# EAGLE design DIYpiano (EAGLE 9.2.2)
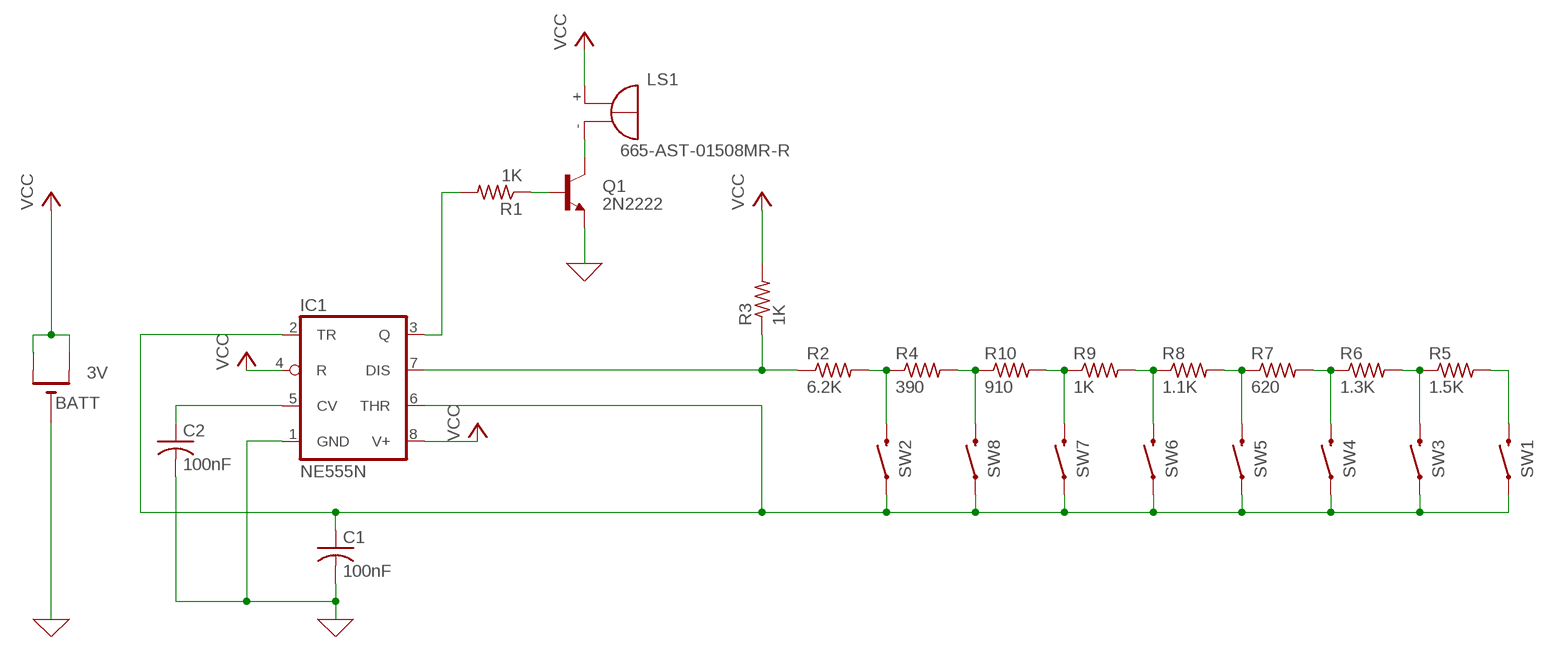
[diagram p0: schematic, sheet 1]

## Parts
BATT  3V  CR1220THM  [CR1220-THM]
C1  100nF  C-US025-025X050  [C025-025X050]
C2  100nF  C-US025-025X050  [C025-025X050]
IC1  NE555N  [DIL08]
LS1  F/HMB  [F/HMB]
Q1  2N2222  -NPN-TO92-E1  [TO92-E1]
R1  1K  R-US_0207/10  [0207/10]
R2  6.2K  R-US_0207/10  [0207/10]
R3  1K  R-US_0207/10  [0207/10]
R4  390  R-US_0207/10  [0207/10]
R5  1.5K  R-US_0207/10  [0207/10]
R6  1.3K  R-US_0207/10  [0207/10]
R7  620  R-US_0207/10  [0207/10]
R8  1.1K  R-US_0207/10  [0207/10]
R9  1K  R-US_0207/10  [0207/10]
R10  910  R-US_0207/10  [0207/10]
SW1  MOMENTARY-SWITCH-SPST-PTH-6.0MM  [TACTILE_SWITCH_PTH_6.0MM]
SW2  MOMENTARY-SWITCH-SPST-PTH-6.0MM  [TACTILE_SWITCH_PTH_6.0MM]
SW3  MOMENTARY-SWITCH-SPST-PTH-6.0MM  [TACTILE_SWITCH_PTH_6.0MM]
SW4  MOMENTARY-SWITCH-SPST-PTH-6.0MM  [TACTILE_SWITCH_PTH_6.0MM]
SW5  MOMENTARY-SWITCH-SPST-PTH-6.0MM  [TACTILE_SWITCH_PTH_6.0MM]
SW6  MOMENTARY-SWITCH-SPST-PTH-6.0MM  [TACTILE_SWITCH_PTH_6.0MM]
SW7  MOMENTARY-SWITCH-SPST-PTH-6.0MM  [TACTILE_SWITCH_PTH_6.0MM]
SW8  MOMENTARY-SWITCH-SPST-PTH-6.0MM  [TACTILE_SWITCH_PTH_6.0MM]

## Nets
GND: BATT.- C1.2 C2.2 IC1.1(GND) Q1.3(E)
N$1: R2.2 R4.1 SW2.3
N$2: IC1.7(DIS) R2.1 R3.1
N$3: C1.1 IC1.2(TR) IC1.6(THR) SW1.1 SW2.1 SW3.1 SW4.1 SW5.1 SW6.1 SW7.1 SW8.1
N$4: R4.2 R10.1 SW8.3
N$5: R9.1 R10.2 SW7.3
N$6: R8.1 R9.2 SW6.3
N$7: R7.1 R8.2 SW5.3
N$8: R6.1 R7.2 SW4.3
N$9: R5.1 R6.2 SW3.3
N$10: R5.2 SW1.3
N$11: IC1.3(Q) R1.2
N$12: C2.1 IC1.5(CV)
N$13: LS1.- Q1.1(C)
N$14: Q1.2(B) R1.1
VCC: BATT.+1(+) BATT.+2(+1) IC1.4(R) IC1.8(V+) LS1.+ R3.2

## Library data of the parts
BATT = adafruit:CR1220: CR1216/CR1220/CR1225 12mm 3V lithium coin cell Great for battery packup. Both SMT and THM holders. Note the THM package has the ground pads on both sides of the PCB so that the masks are the same - this reduces the cost; MF: KEYSTONE ELECTR; MOUSER#: 534-3001; MPN: 3001; OC_NEWARK: 66F5623
C1 C2 = rcl:C-US: CAPACITOR, American symbol; MOUSER#: 581-SR201C104KARTR1; OC_NEWARK: unknown; SPICEPREFIX: C
IC1 = linear:*555: TIMER; MOUSER#: 595-TLC555CP; MPN: TLC555CP; OC_NEWARK: 24M8296
LS1 = buzzer:F/HMB: BUZZER Source: Buerklin; MOUSER#: 665-AST-01508MR-R; OC_FARNELL: unknown; OC_NEWARK: unknown
Q1 = transistor:*-NPN-: NPN Transistror BF959 corrected 2008.03.06; MF: FAIRCHILD SEMICONDUCTOR; MOUSER#: 833-PN2222A-AP; MPN: PN2222ATF; OC_NEWARK: 58K2048
R1 R3 R9 = rcl:R-US_: RESISTOR, American symbol; MOUSER#: 660-MF1/4DCT26A1001F; OC_NEWARK: unknown; SPICEPREFIX: R
R2 = rcl:R-US_: RESISTOR, American symbol; MOUSER#: 603-MFR-25FRF52-6K2; OC_NEWARK: unknown; SPICEPREFIX: R
R4 = rcl:R-US_: RESISTOR, American symbol; MOUSER#: 603-MFR-25FTE52-390R; OC_NEWARK: unknown; SPICEPREFIX: R
R5 = rcl:R-US_: RESISTOR, American symbol; MOUSER#: 603-MFR-25FBF52-1K5; OC_NEWARK: unknown; SPICEPREFIX: R
R6 = rcl:R-US_: RESISTOR, American symbol; MOUSER#: 603-MFR-25FBF52-1K3; OC_NEWARK: unknown; SPICEPREFIX: R
R7 = rcl:R-US_: RESISTOR, American symbol; MOUSER#: 603-MFR-25FBF52-620R; OC_NEWARK: unknown; SPICEPREFIX: R
R8 = rcl:R-US_: RESISTOR, American symbol; MOUSER#: 603-MFR-25FBF52-1K1; OC_NEWARK: unknown; SPICEPREFIX: R
R10 = rcl:R-US_: RESISTOR, American symbol; MOUSER#: 603-MFR-25FRF52-910R; OC_NEWARK: unknown; SPICEPREFIX: R
SW1-SW8 = SparkFun-Switches:MOMENTARY-SWITCH-SPST: Momentary Switch (Pushbutton) - SPST Normally-open (NO) SPST momentary switches (buttons, pushbuttons). Variants PTH-12MM - 12mm square, through-hole Momentary Pushbutton Switch - 12mm Square <https://www.sparkfun.com/products/9190> (COM-09190) PTH-6.0MM, PTH-6.0MM-KIT - 6.0mm square, through-hole Mini Pushbutton Switch <https://www.sparkfun.com/products/97> (COM-00097) KIT package intended for soldering kit's - only one side of pads' copper is exposed. PTH-RIGHT-ANGLE-KIT - Right-angle, through-hole Right Angle Tactile Button <https://www.sparkfun.com/products/10791> - Used on SparkFun BigTime Watch Kit <https://www.sparkfun.com/products/11734> SMD-12MM - 12mm square, surface-mount Tactile Button - SMD (12mm) <https://www.sparkfun.com/products/12993> (COM-12993) Used on SparkFun PicoBoard <https://www.sparkfun.com/products/11888> SMD-4.5MM - 4.5mm Square Trackball Switch Used on SparkFun Blackberry Trackballer Breakout <https://www.sparkfun.com/products/13169> SMD-4.6MMX2.8MM - 4.60mm x 2.80mm, surface mount Used on SparkFun SAMD21 Mini Breakout <https://www.sparkfun.com/products/13664> SMD-5.2MM, SMD-5.2-REDUNDANT - 5.2mm square, surface-mount Mini Pushbutton Switch - SMD <https://www.sparkfun.com/products/8720> (COM-08720) Used on Arduino Pro Mini <https://www.sparkfun.com/products/11114> REDUNDANT package connects both switch circuits together SMD-6.0X3.5MM - 6.0 x 3.5mm, surface mount Momentary Reset Switch SMD <https://www.sparkfun.com/products/8229> (COM-08229) SMD-6.2MM-TALL - 6.2mm square, surface mount Tactile Button - SMD (6mm) <https://www.sparkfun.com/products/12992> Used on SparkFun Digital Sandbox <https://www.sparkfun.com/products/12651> SMD-RIGHT-ANGLE - Right-angle, surface mount Used on SparkFun Block for Intel® Edison - Arduino <https://www.sparkfun.com/products/13036>; MOUSER#: 653-B3F-1000; OC_NEWARK: unknown; PROD_ID: SWCH-08441; SF_SKU: COM-00097

## Net classes
0 default: width 0.305 mm, drill 0.508 mm, clearance 0.508 mm

## Board
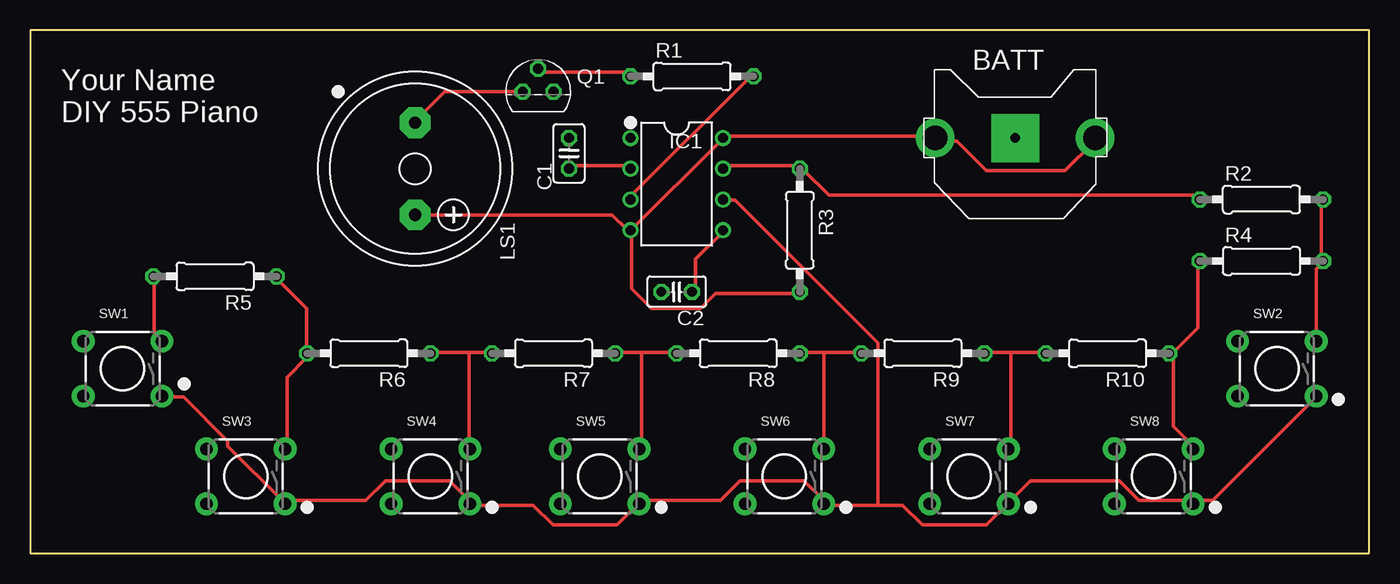
[diagram p1: board, top side]
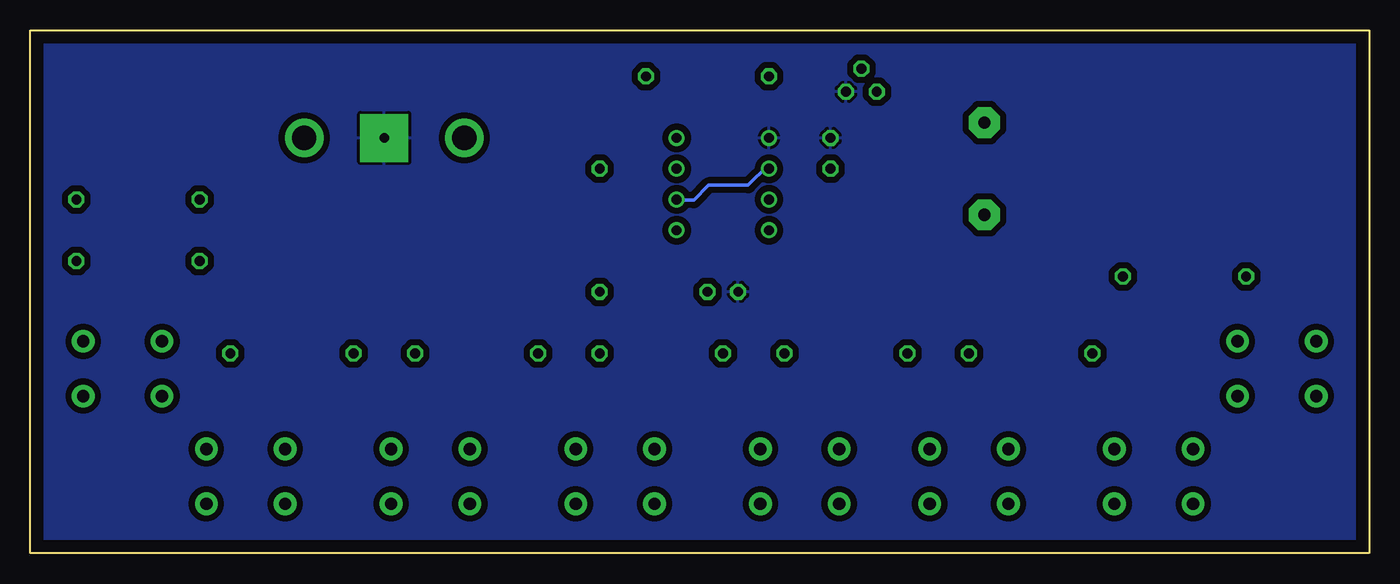
[diagram p2: board, bottom side, seen from below]

Size 110.49 x 43.18 mm. Coordinates in mm from the lower left corner, seen from the top.
Outline: 0,43.18 0,0 110.49,0 110.49,43.18 0,43.18
Copper layers (1*16): Top 0.035mm / dielectric 1.5mm / Bottom 0.035mm
Design rules "default *": minimum track width 12mil, minimum drill 0.35mm, track to track 12mil, track to pad 12mil, pad to pad 12mil, via to via 12mil, smd to smd 6mil, copper to edge 40mil, drill to drill 6mil, minimum pad ring 10mil, minimum via ring 8mil, stop-mask expansion 4mil, vias tented up to drill 0mil, thermal gap 10mil

### Footprints (pad centres in the part's own frame; a part is rotated, then mirrored left to right if it is on the bottom)
CR1220-THM = drill 2 pad 3.175: +1 -6.604,0; +2 6.604,0 | drill 0.8 pad 3.962 square: - 0,0
C025-025X050 = drill 0.813 octagon: 1 -1.27,0; 2 1.27,0
DIL08 = drill 0.813 pad 1.27: 1 -3.81,-3.81; 2 -1.27,-3.81; 3 1.27,-3.81; 4 3.81,-3.81; 5 3.81,3.81; 6 1.27,3.81; 7 -1.27,3.81; 8 -3.81,3.81
F/HMB = drill 1.016 pad 2.54 octagon: + 3.81,0; - -3.81,0
TO92-E1 = drill 0.813 octagon: 1 -1.27,0; 2 0,1.905; 3 1.27,0
0207/10 = drill 0.813 octagon: 1 -5.08,0; 2 5.08,0
TACTILE_SWITCH_PTH_6.0MM = drill 1.016 pad 1.88: 1 -3.251,2.261; 2 3.251,2.261; 3 -3.251,-2.261; 4 3.251,-2.261

### Placement (x,y rotation side)
BATT  81.28,34.29 0 top
C1  44.45,33.02 90 top
C2  53.34,21.59 180 top
IC1  53.34,30.48 270 top
LS1  31.75,31.75 270 top
Q1  41.91,38.1 0 top
R1  54.61,39.37 0 top
R2  101.6,29.21 0 top
R3  63.5,26.67 270 top
R4  101.6,24.13 180 top
R5  15.24,22.86 180 top
R6  27.94,16.51 180 top
R7  43.18,16.51 180 top
R8  58.42,16.51 180 top
R9  73.66,16.51 180 top
R10  88.9,16.51 180 top
SW1  7.62,15.24 180 top
SW2  102.87,15.24 180 top
SW3  17.78,6.35 180 top
SW4  33.02,6.35 180 top
SW5  46.99,6.35 180 top
SW6  62.23,6.35 180 top
SW7  77.47,6.35 180 top
SW8  92.71,6.35 180 top

### Tracks (layer width: path | path; a pad name or v marks a point on that pad's centre or on a via)
GND
  pour Bottom (isolate 0.406): -1.27,44.45 111.76,44.45 111.76,-1.27 -1.27,-1.27
N$1
  Top 0.305: R2.2 106.53,29.16 106.53,24.28 R4.1 106.53,23.88 106.12,23.47 SW2.3
N$2
  Top 0.305: IC1.7 57.35,32 63.45,32 R3.1 63.86,31.6 65.89,29.57 96.37,29.57 R2.1
N$3
  Top 0.305: 95.96,4.37 97.59,4.37 106.12,12.9 SW2.1 | SW1.1 11.02,12.9 12.65,12.9 16.31,9.25 16.31,8.84 20.78,4.37 SW3.1 21.18,4.37 27.69,4.37 29.31,5.99 34.6,5.99 36.22,4.37 SW4.1 36.63,3.96 41.5,3.96 43.13,2.34 48.41,2.34 50.04,3.96 SW5.1 50.44,4.37 56.95,4.37 58.57,5.99 63.86,5.99 65.48,4.37 SW6.1 65.48,3.96 69.95,3.96 | C1.1 44.76,32 49.23,32 IC1.2 | 69.95,3.96 71.98,3.96 73.61,2.34 78.89,2.34 80.52,3.96 SW7.1 80.92,4.37 82.55,5.99 89.86,5.99 91.49,4.37 95.96,4.37 | 69.95,3.96 69.95,17.37 58.17,29.16 57.35,29.16 IC1.6 | 95.96,4.37 SW8.1
  Bottom 0.305: IC1.6 56.95,29.16 55.73,29.16 54.51,30.38 51.26,30.38 49.63,32 IC1.2
N$4
  Top 0.305: SW8.3 95.96,8.84 94.34,10.46 94.34,16.15 R10.1 94.34,16.56 96.37,18.59 96.37,23.88 R4.2
N$5
  Top 0.305: 80.92,16.56 83.77,16.56 R10.2 | 80.92,16.56 78.89,16.56 R9.1 | 80.92,16.56 80.92,8.84 SW7.3
N$6
  Top 0.305: 65.48,16.56 68.33,16.56 R9.2 | 65.48,16.56 63.86,16.56 R8.1 | 65.48,16.56 SW6.3
N$7
  Top 0.305: 50.44,16.56 53.29,16.56 R8.2 | 50.44,16.56 48.41,16.56 R7.1 | 50.44,16.56 50.44,8.84 SW5.3
N$8
  Top 0.305: 36.22,16.56 37.85,16.56 R7.2 | 36.22,16.56 33.38,16.56 R6.1 | 36.22,16.56 36.22,8.84 SW4.3
N$9
  Top 0.305: R5.1 20.37,22.66 22.81,20.22 22.81,16.56 R6.2 22.81,16.15 21.18,14.53 21.18,8.84 SW3.3
N$10
  Top 0.305: R5.2 10.21,22.66 10.21,18.19 10.62,17.78 SW1.3
N$11
  Top 0.305: IC1.3 49.63,29.57 59.39,39.32 R1.2
N$12
  Top 0.305: C2.1 54.92,21.84 54.92,24.28 56.95,26.31 IC1.5
N$13
  Top 0.305: Q1.1 34.19,38.1 31.75,35.66 LS1.-
N$14
  Top 0.305: R1.1 49.23,39.73 41.91,39.73 Q1.2
VCC
  Top 0.305: BATT.+2 87.83,34.04 85.39,31.6 78.89,31.6 76.45,34.04 74.83,34.04 BATT.+1 74.42,34.44 57.35,34.44 IC1.8 56.95,34.04 49.63,26.72 IC1.4 | R3.2 63.45,21.44 56.54,21.44 55.32,20.22 51.26,20.22 49.63,21.84 49.63,26.31 IC1.4 | LS1.+ 48.01,27.94 49.23,26.72 IC1.4

### Text on the board
tPlace: Your Name / DIY 555 Piano